# EAGLE design sensing_unit_rev2 (EAGLE 8.3.2)
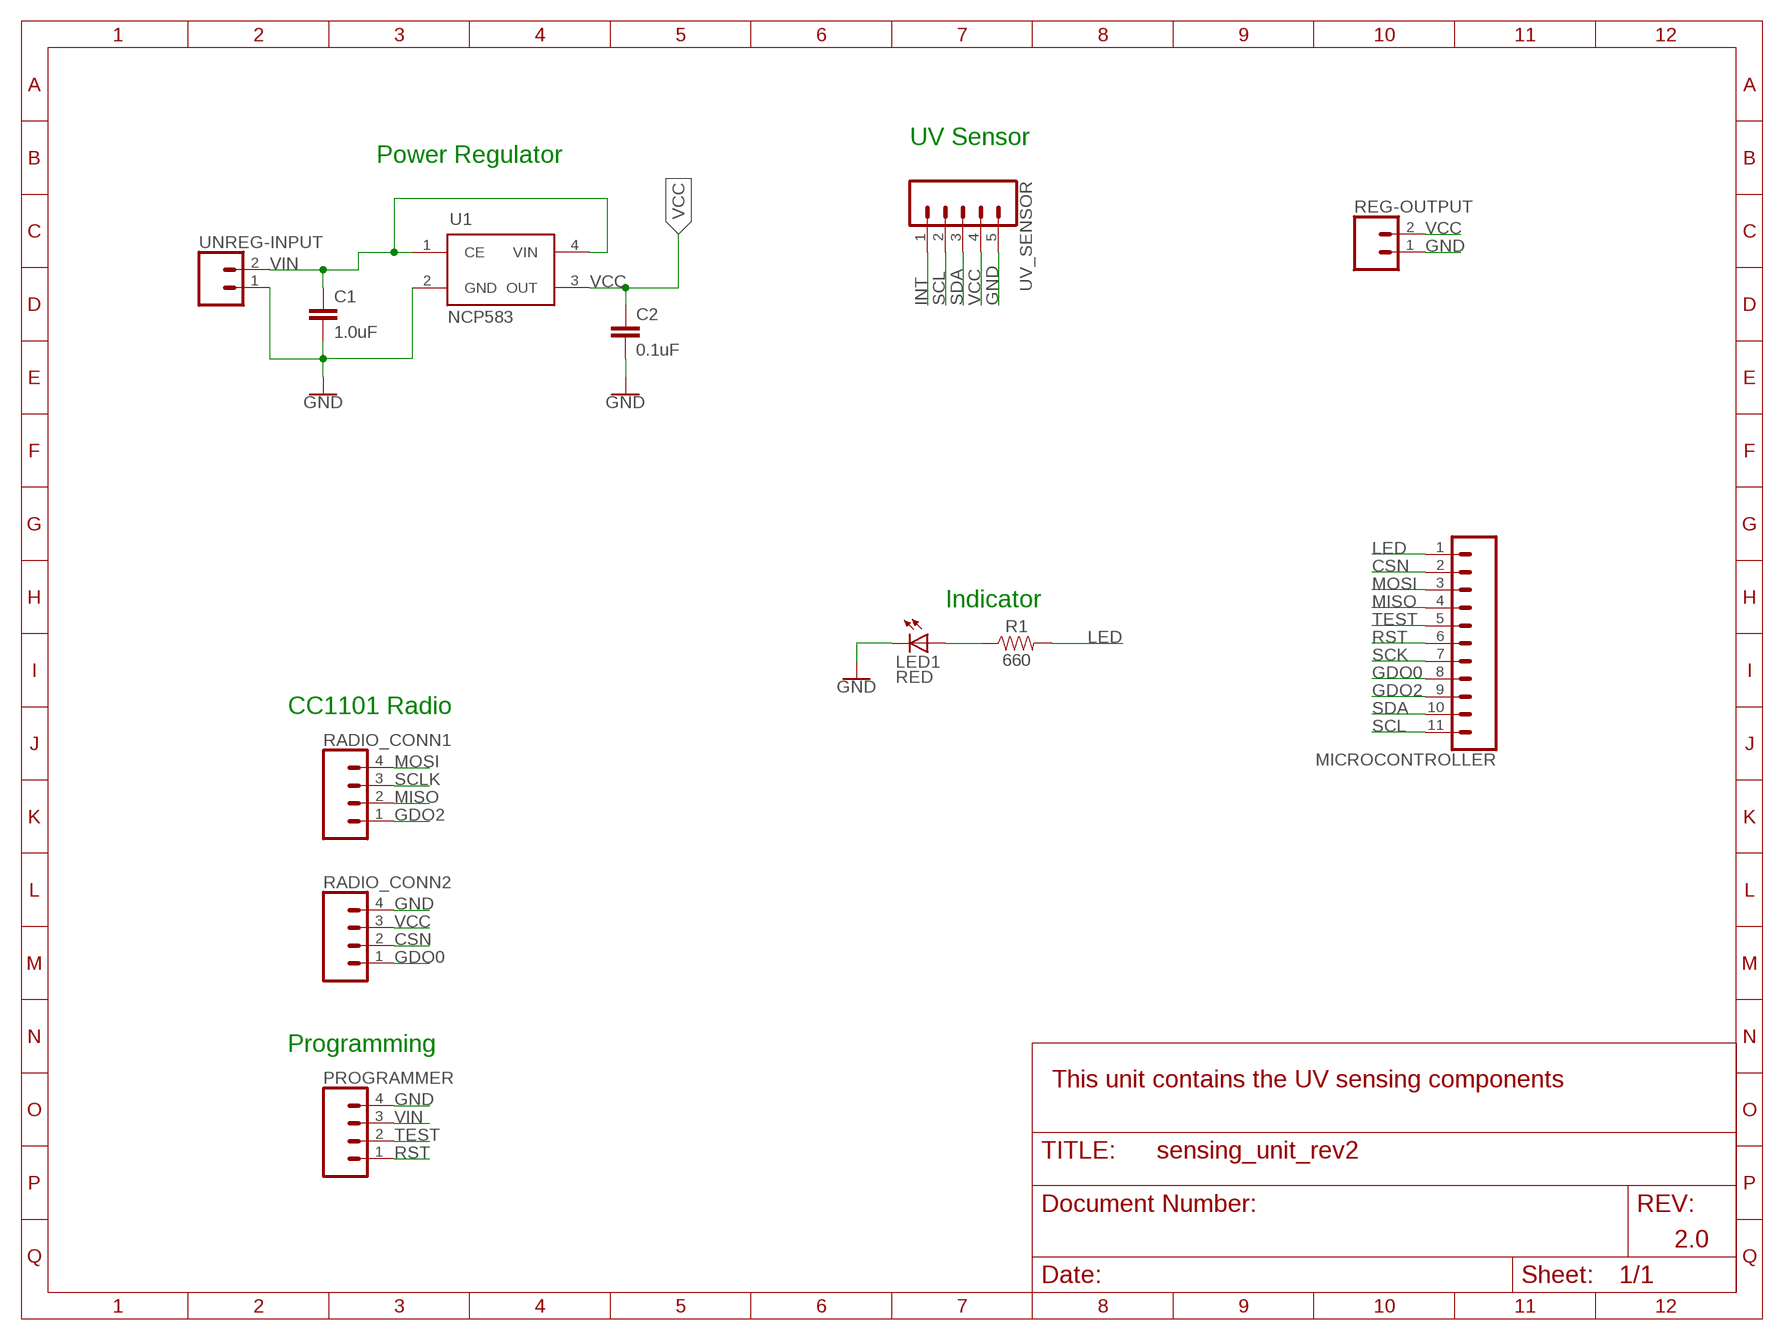
[diagram p0: schematic, sheet 1]

## Parts
C1  1.0uF  1.0UF-0805-25V-(+80/-20%)  [0805]
C2  0.1uF  1.0UF-0805-25V-(+80/-20%)  [0805]
LED1  RED  LEDCHIP-LED0805  [CHIP-LED0805]
MICROCONTROLLER  CONN_11  [1X11]
PROGRAMMER  CONN_04  [1X04]
R1  660  RESISTOR0805  [0805]
RADIO_CONN1  CONN_04  [1X04]
RADIO_CONN2  CONN_04  [1X04]
REG-OUTPUT  CONN_02  [1X02]
U1  NCP583  [SC82-AB_1PRIMARY]
UNREG-INPUT  CONN_02  [1X02]
UV_SENSOR  CONN_05  [1X05]

## Nets
CSN: MICROCONTROLLER.2 RADIO_CONN2.2
GDO0: MICROCONTROLLER.8 RADIO_CONN2.1
GDO2: MICROCONTROLLER.9 RADIO_CONN1.1
GND: C1.2 C2.2 LED1.C PROGRAMMER.4 RADIO_CONN2.4 REG-OUTPUT.1 U1.2(GND) UNREG-INPUT.1 UV_SENSOR.5
INT: UV_SENSOR.1
LED: MICROCONTROLLER.1 R1.2
MISO: MICROCONTROLLER.4 RADIO_CONN1.2
MOSI: MICROCONTROLLER.3 RADIO_CONN1.4
N$2: LED1.A R1.1
RST: MICROCONTROLLER.6 PROGRAMMER.1
SCK: MICROCONTROLLER.7
SCL: MICROCONTROLLER.11 UV_SENSOR.2
SCLK: RADIO_CONN1.3
SDA: MICROCONTROLLER.10 UV_SENSOR.3
TEST: MICROCONTROLLER.5 PROGRAMMER.2
VCC: C2.1 RADIO_CONN2.3 REG-OUTPUT.2 U1.3(OUT) UV_SENSOR.4
VIN: C1.1 PROGRAMMER.3 U1.1(CE) U1.4(VIN) UNREG-INPUT.2

## Notes on the sheet
- UV Sensor
- Power Regulator
- Indicator
- CC1101 Radio
- Programming
- This unit contains the UV sensing components
- 2.0

## Library data of the parts
C1 = SparkFun-Capacitors:1.0UF: 1µF ceramic capacitors A capacitor is a passive two-terminal electrical component used to store electrical energy temporarily in an electric field.; PROD_ID: CAP-11625
C2 = SparkFun-Capacitors:1.0UF: 1µF ceramic capacitors A capacitor is a passive two-terminal electrical component used to store electrical energy temporarily in an electric field.; PROD_ID: CAP-11625; VALUE: 1.0uF
LED1 = led:LED: LED OSRAM: - CHIPLED LG R971, LG N971, LY N971, LG Q971, LY Q971, LO R971, LY R971 LH N974, LH R974 LS Q976, LO Q976, LY Q976 LO Q996 - Hyper CHIPLED LW Q18S LB Q993, LB Q99A, LB R99A - SideLED LS A670, LO A670, LY A670, LG A670, LP A670 LB A673, LV A673, LT A673, LW A673 LH A674 LY A675 LS A676, LA A676, LO A676, LY A676, LW A676 LS A679, LY A679, LG A679 - Hyper Micro SIDELED® LS Y876, LA Y876, LO Y876, LY Y876 LT Y87S - SmartLED LW L88C, LW L88S LB L89C, LB L89S, LG L890 LS L89K, LO L89K, LY L89K LS L896, LA L896, LO L896, LY L896 - TOPLED LS T670, LO T670, LY T670, LG T670, LP T670 LSG T670, LSP T670, LSY T670, LOP T670, LYG T670 LG T671, LOG T671, LSG T671 LB T673, LV T673, LT T673, LW T673 LH T674 LS T676, LA T676, LO T676, LY T676, LB T676, LH T676, LSB T676, LW T676 LB T67C, LV T67C, LT T67C, LS T67K, LO T67K, LY T67K, LW E67C LS E67B, LA E67B, LO E67B, LY E67B, LB E67C, LV E67C, LT E67C LW T67C LS T679, LY T679, LG T679 LS T770, LO T770, LY T770, LG T770, LP T770 LB T773, LV T773, LT T773, LW T773 LH T774 LS E675, LA E675, LY E675, LS T675 LS T776, LA T776, LO T776, LY T776, LB T776 LHGB T686 LT T68C, LB T68C - Hyper Mini TOPLED® LB M676 - Mini TOPLED Santana® LG M470 LS M47K, LO M47K, LY M47K Source: http://www.osram.convergy.de LUXEON: - LUMILED® LXK2-PW12-R00, LXK2-PW12-S00, LXK2-PW14-U00, LXK2-PW14-V00 LXK2-PM12-R00, LXK2-PM12-S00, LXK2-PM14-U00 LXK2-PE12-Q00, LXK2-PE12-R00, LXK2-PE12-S00, LXK2-PE14-T00, LXK2-PE14-U00 LXK2-PB12-K00, LXK2-PB12-L00, LXK2-PB12-M00, LXK2-PB14-N00, LXK2-PB14-P00, LXK2-PB14-Q00 LXK2-PR12-L00, LXK2-PR12-M00, LXK2-PR14-Q00, LXK2-PR14-R00 LXK2-PD12-Q00, LXK2-PD12-R00, LXK2-PD12-S00 LXK2-PH12-R00, LXK2-PH12-S00 LXK2-PL12-P00, LXK2-PL12-Q00, LXK2-PL12-R00 Source: www.luxeon.com KINGBRIGHT: KA-3528ASYC Source: www.kingbright.com
MICROCONTROLLER = SparkFun-Connectors:CONN_11: Multi connection point. Often used as Generic Header-pin footprint for 0.1 inch spaced/style header connections On any of the 0.1 inch spaced packages, you can populate with these: Break Away Headers - Straight <https://www.sparkfun.com/products/116> (PRT-00116) Break Away Male Headers - Right Angle <https://www.sparkfun.com/products/553> (PRT-00553) Female Headers <https://www.sparkfun.com/products/115> (PRT-00115) Break Away Headers - Machine Pin <https://www.sparkfun.com/products/117> (PRT-00117) Break Away Female Headers - Swiss Machine Pin <https://www.sparkfun.com/products/743> (PRT-00743) For SCREWTERMINALS and SPRING TERMINALS visit here: Screw Terimnals on SparkFun.com <https://www.sparkfun.com/search/results?term=Screw+Terminals> (5mm/3.5mm/2.54mm spacing) This device is also useful as a general connection point to wire up your design to another part of your project. Our various solder wires solder well into these plated through hole pads. Hook-Up Wire - Assortment (Stranded, 22 AWG) <https://www.sparkfun.com/products/11375> (PRT-11375) Hook-Up Wire - Assortment (Solid Core, 22 AWG) <https://www.sparkfun.com/products/11367> (PRT-11367) View the entire wire category on our website here <https://www.sparkfun.com/categories/141>
PROGRAMMER RADIO_CONN1 RADIO_CONN2 = SparkFun-Connectors:CONN_04: Multi connection point. Often used as Generic Header-pin footprint for 0.1 inch spaced/style header connections On any of the 0.1 inch spaced packages, you can populate with these: Break Away Headers - Straight <https://www.sparkfun.com/products/116> (PRT-00116) Break Away Male Headers - Right Angle <https://www.sparkfun.com/products/553> (PRT-00553) Female Headers <https://www.sparkfun.com/products/115> (PRT-00115) Break Away Headers - Machine Pin <https://www.sparkfun.com/products/117> (PRT-00117) Break Away Female Headers - Swiss Machine Pin <https://www.sparkfun.com/products/743> (PRT-00743) For SCREWTERMINALS and SPRING TERMINALS visit here: Screw Terimnals on SparkFun.com <https://www.sparkfun.com/search/results?term=Screw+Terminals> (5mm/3.5mm/2.54mm spacing) This device is also useful as a general connection point to wire up your design to another part of your project. Our various solder wires solder well into these plated through hole pads. Hook-Up Wire - Assortment (Stranded, 22 AWG) <https://www.sparkfun.com/products/11375> (PRT-11375) Hook-Up Wire - Assortment (Solid Core, 22 AWG) <https://www.sparkfun.com/products/11367> (PRT-11367) View the entire wire category on our website here <https://www.sparkfun.com/categories/141> Special notes: Molex polarized connector foot print use with SKU : PRT-08231 with associated crimp pins and housings. 1MM SMD Version SKU: PRT-10208; PROD_ID: CONN-09696
R1 = SparkFun-Resistors:RESISTOR: Generic Resistor Package
REG-OUTPUT UNREG-INPUT = SparkFun-Connectors:CONN_02: Multi connection point. Often used as Generic Header-pin footprint for 0.1 inch spaced/style header connections On any of the 0.1 inch spaced packages, you can populate with these: Break Away Headers - Straight <https://www.sparkfun.com/products/116> (PRT-00116) Break Away Male Headers - Right Angle <https://www.sparkfun.com/products/553> (PRT-00553) Female Headers <https://www.sparkfun.com/products/115> (PRT-00115) Break Away Headers - Machine Pin <https://www.sparkfun.com/products/117> (PRT-00117) Break Away Female Headers - Swiss Machine Pin <https://www.sparkfun.com/products/743> (PRT-00743) For SCREWTERMINALS and SPRING TERMINALS visit here: Screw Terimnals on SparkFun.com <https://www.sparkfun.com/search/results?term=Screw+Terminals> (5mm/3.5mm/2.54mm spacing) This device is also useful as a general connection point to wire up your design to another part of your project. Our various solder wires solder well into these plated through hole pads. Hook-Up Wire - Assortment (Stranded, 22 AWG) <https://www.sparkfun.com/products/11375> (PRT-11375) Hook-Up Wire - Assortment (Solid Core, 22 AWG) <https://www.sparkfun.com/products/11367> (PRT-11367) View the entire wire category on our website here <https://www.sparkfun.com/categories/141> Special notes: Molex polarized connector foot print use with: PRT-08233 with associated crimp pins and housings. 2.54_SCREWTERM for use with PRT-10571. 3.5mm Screw Terminal footprints for PRT-08084 5mm Screw Terminal footprints for use with PRT-08432
U1 = ncp583:NCP583: NCP583 - Ultra-Low Iq 150 mA CMOS LDO Regulator with Enable The NCP583 series of low dropout regulators are designed for portable battery powered applications which require precise output voltage accuracy and low quiescent current. These devices feature an enable function which lowers current consumption significantly and are offered in two small packages; SC−82AB and the SOT−563. A 1.0 mF ceramic capacitor is the recommended value to be used with these devices on the output pin.
UV_SENSOR = SparkFun-Connectors:CONN_05: Multi connection point. Often used as Generic Header-pin footprint for 0.1 inch spaced/style header connections On any of the 0.1 inch spaced packages, you can populate with these: Break Away Headers - Straight <https://www.sparkfun.com/products/116> (PRT-00116) Break Away Male Headers - Right Angle <https://www.sparkfun.com/products/553> (PRT-00553) Female Headers <https://www.sparkfun.com/products/115> (PRT-00115) Break Away Headers - Machine Pin <https://www.sparkfun.com/products/117> (PRT-00117) Break Away Female Headers - Swiss Machine Pin <https://www.sparkfun.com/products/743> (PRT-00743) For SCREWTERMINALS and SPRING TERMINALS visit here: Screw Terimnals on SparkFun.com <https://www.sparkfun.com/search/results?term=Screw+Terminals> (5mm/3.5mm/2.54mm spacing) This device is also useful as a general connection point to wire up your design to another part of your project. Our various solder wires solder well into these plated through hole pads. Hook-Up Wire - Assortment (Stranded, 22 AWG) <https://www.sparkfun.com/products/11375> (PRT-11375) Hook-Up Wire - Assortment (Solid Core, 22 AWG) <https://www.sparkfun.com/products/11367> (PRT-11367) View the entire wire category on our website here <https://www.sparkfun.com/categories/141> Special notes: Molex polarized connector foot print use with SKU : PRT-08231 with associated crimp pins and housings. 1MM SMD Version SKU: PRT-10208

## Net classes
0 default: width 0.305 mm, drill 0.508 mm, clearance 0.254 mm

## Board
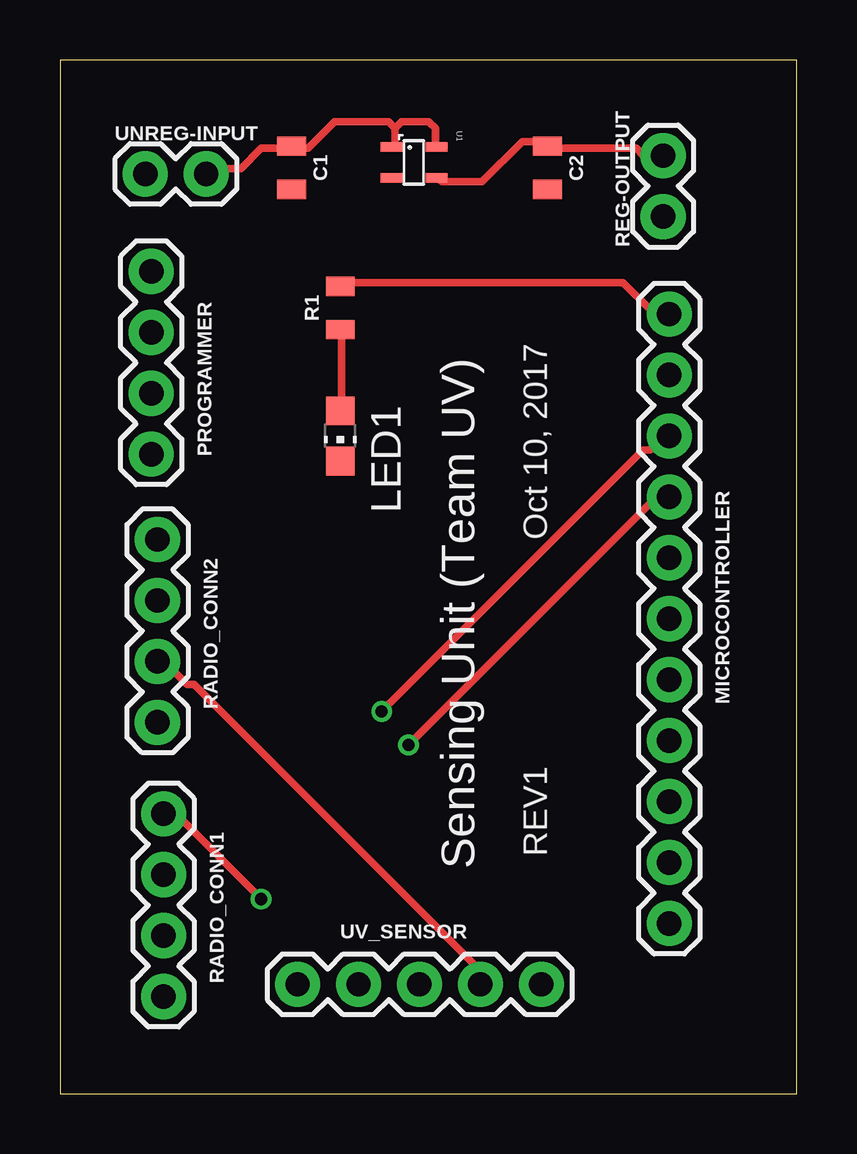
[diagram p1: board, top side]
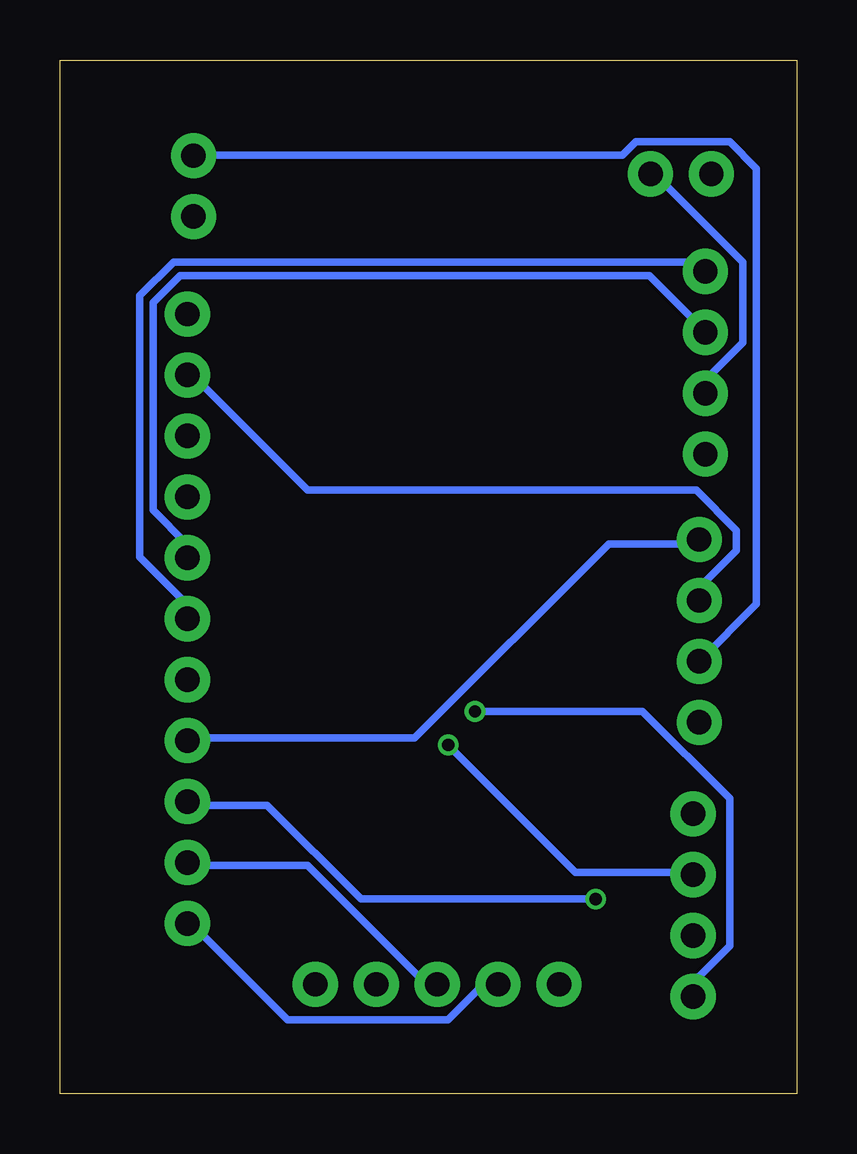
[diagram p2: board, bottom side, seen from below]

Size 30.71 x 43.1 mm. Coordinates in mm from the lower left corner, seen from the top.
Outline: 0,0 30.71,0 30.71,43.1 0,43.1 0,0
Copper layers (1*16): Top 0.0356mm / dielectric 1.5011mm / Bottom 0.0356mm
Design rules "oshpark-2layer": minimum track width 6mil, minimum drill 13mil, track to track 6mil, track to pad 6mil, pad to pad 6mil, via to via 6mil, smd to smd 6mil, copper to edge 15mil, drill to drill 6mil, minimum pad ring 7mil, minimum via ring 7mil, stop-mask expansion 2.5mil, vias tented up to drill 0mil, thermal gap 10mil

### Footprints (pad centres in the part's own frame; a part is rotated, then mirrored left to right if it is on the bottom)
0805 = smd 0.8 x 1.2: 1 -0.9,0; 2 0.9,0
CHIP-LED0805 = smd 1.2 x 1.2: A 0,-1.05; C 0,1.05
1X11 = drill 1.016 pad 1.88: 1 0,0; 2 2.54,0; 3 5.08,0; 4 7.62,0; 5 10.16,0; 6 12.7,0; 7 15.24,0; 8 17.78,0; 9 20.32,0; 10 22.86,0; 11 25.4,0
1X04 = drill 1.016 pad 1.88: 1 0,0; 2 2.54,0; 3 5.08,0; 4 7.62,0
1X02 = drill 1.016 pad 1.88: 1 0,0; 2 2.54,0
SC82-AB_1PRIMARY = smd 0.406 x 0.914: 1 -0.621,-0.913; 2 0.675,-0.913; 3 0.675,0.967; 4 -0.621,0.967
1X05 = drill 1.016 pad 1.88: 1 0,0; 2 2.54,0; 3 5.08,0; 4 7.62,0; 5 10.16,0

### Placement (x,y rotation side)
C1  9.65,38.61 270 top
C2  20.32,38.61 270 top
LED1  11.68,27.43 180 top
MICROCONTROLLER  25.4,32.51 270 top
PROGRAMMER  3.81,34.29 270 top
R1  11.68,32.77 90 top
RADIO_CONN1  4.32,11.68 270 top
RADIO_CONN2  4.06,23.11 270 top
REG-OUTPUT  25.15,36.58 90 top
U1  14.73,38.86 270 top
UNREG-INPUT  3.56,38.35 0 top
UV_SENSOR  9.91,4.57 0 top

### Tracks (layer width: path | path; a pad name or v marks a point on that pad's centre or on a via)
CSN
  Bottom 0.305: RADIO_CONN2.2 3.91,20.7 3.91,21.26 2.52,22.66 2.52,23.49 4.19,25.17 20.4,25.17 25.15,29.92 MICROCONTROLLER.2
GDO0
  Bottom 0.305: MICROCONTROLLER.8 25.15,14.83 15.93,14.83 7.82,22.94 4.19,22.94 RADIO_CONN2.1
GDO2  (via drill 0.51)
  Top 0.305: v8.38,8.13 5.03,11.48 4.47,11.48 RADIO_CONN1.1
  Bottom 0.305: v8.38,8.13 18.16,8.13 22.07,12.04 25.15,12.04 MICROCONTROLLER.9
LED
  Top 0.305: R1.2 11.73,33.83 23.47,33.83 24.59,32.72 25.15,32.72 MICROCONTROLLER.1
MISO  (via drill 0.51)
  Top 0.305: v14.53,14.55 24.87,24.89 MICROCONTROLLER.4
  Bottom 0.305: v14.53,14.55 9.22,9.25 4.47,9.25 RADIO_CONN1.2
MOSI  (via drill 0.51)
  Top 0.305: v13.41,15.95 24.31,26.85 24.59,26.85 25.15,27.41 MICROCONTROLLER.3
  Bottom 0.305: v13.41,15.95 6.43,15.95 2.79,12.32 2.79,6.17 4.19,4.78 4.19,4.22 RADIO_CONN1.4
N$2
  Top 0.305: LED1.A 11.73,28.52 11.73,31.6 R1.1
RST
  Bottom 0.305: PROGRAMMER.1 4.19,34.67 25.98,34.67 27.38,33.27 27.38,22.38 25.43,20.42 25.43,19.86 MICROCONTROLLER.6
SCL
  Bottom 0.305: UV_SENSOR.2 12.57,4.5 13.13,4.5 14.53,3.1 21.23,3.1 25.15,7.01 MICROCONTROLLER.11
SDA
  Bottom 0.305: UV_SENSOR.3 15.09,4.78 15.65,4.78 20.4,9.53 25.15,9.53 MICROCONTROLLER.10
TEST
  Bottom 0.305: MICROCONTROLLER.5 25.43,22.38 25.43,22.94 26.82,24.33 26.82,33 25.7,34.11 6.15,34.11 3.91,31.88 PROGRAMMER.2
VCC
  Top 0.305: U1.3 15.93,38.02 17.6,38.02 19.28,39.7 20.12,39.7 C2.1 20.4,39.42 24.03,39.42 24.31,39.14 25.15,39.14 REG-OUTPUT.2 | UV_SENSOR.4 17.32,4.78 17.32,5.33 5.59,17.07 5.31,17.07 4.19,18.19 RADIO_CONN2.3
  Bottom 0.305: RADIO_CONN2.3 1.68,20.42 1.68,38.58 2.79,39.7 6.71,39.7 7.26,39.14 25.15,39.14 REG-OUTPUT.2
VIN
  Top 0.305: 13.97,40.26 13.97,39.42 U1.1 | 13.97,40.26 14.25,40.54 15.37,40.54 15.65,40.26 15.65,39.42 U1.4 | UNREG-INPUT.2 6.15,38.58 7.54,38.58 8.38,39.42 9.5,39.42 C1.1 9.78,39.42 10.34,39.42 11.46,40.54 13.69,40.54 13.97,40.26
  Bottom 0.305: PROGRAMMER.3 3.63,29.36 3.63,29.92 2.23,31.32 2.23,34.67 5.87,38.3 UNREG-INPUT.2

### Text on the board
tPlace: Oct 10, 2017 | Sensing Unit (Team UV) | REV1